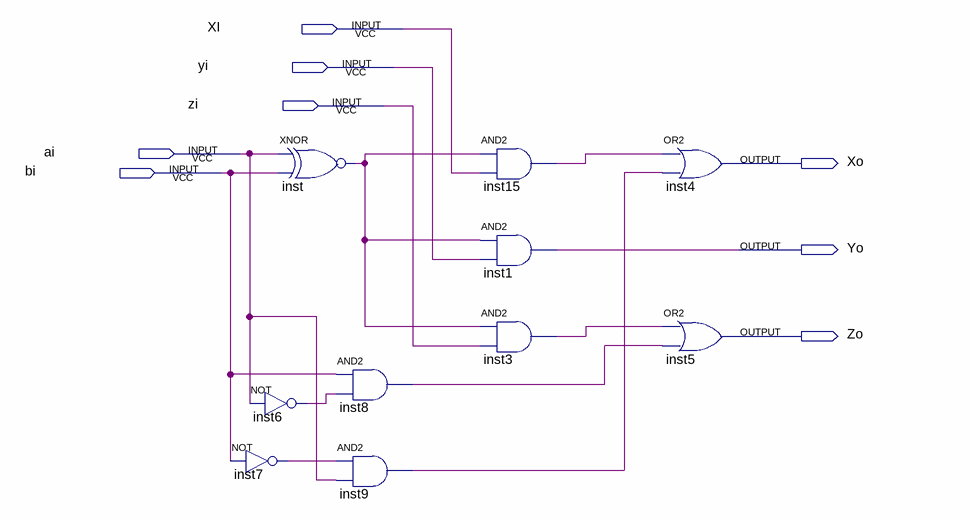
[diagram p0: schematic sheet]
// Quartus schematic Cmp1bit.bdf as structural Verilog: 10 symbols, 8 pins
module Cmp1bit (
  input  XI,
  input  yi,
  input  zi,
  input  ai,
  input  bi,
  output Xo,
  output Yo,
  output Zo
);

  wire inst3_out, inst6_out, inst7_out, inst8_out, inst9_out, inst15_out, inst_out;

  xnor inst (inst_out, ai, bi);
  not inst6 (inst6_out, ai);
  not inst7 (inst7_out, bi);
  and inst8 (inst8_out, bi, inst6_out);
  and inst9 (inst9_out, inst7_out, ai);
  and inst15 (inst15_out, inst_out, XI);
  and inst1 (Yo, inst_out, yi);
  and inst3 (inst3_out, inst_out, zi);
  or inst4 (Xo, inst15_out, inst9_out);
  or inst5 (Zo, inst3_out, inst8_out);
endmodule
